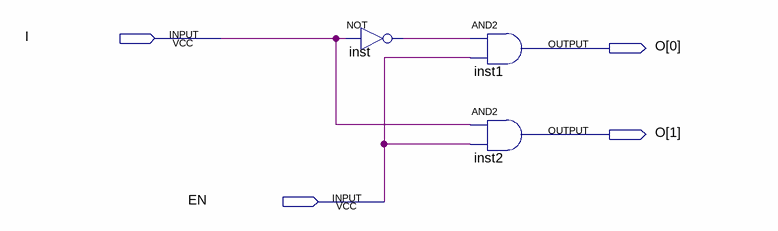
[diagram p0: schematic sheet]
// Quartus schematic Decorder1to2.bdf as structural Verilog: 3 symbols, 4 pins
module Decorder1to2 (
  input  I,
  input  EN,
  output [1:0] O
);

  wire inst_out;

  not inst (inst_out, I);
  and inst1 (O[0], inst_out, EN);
  and inst2 (O[1], I, EN);
endmodule
